# Altium schematic sheet SH2 - MCU.SchDoc
size Letter; Organization: UW Robotics; Address1: 200 University Avenue; Address2: Waterloo; Address3: Ontario; Address4: Canada N2L 3G6
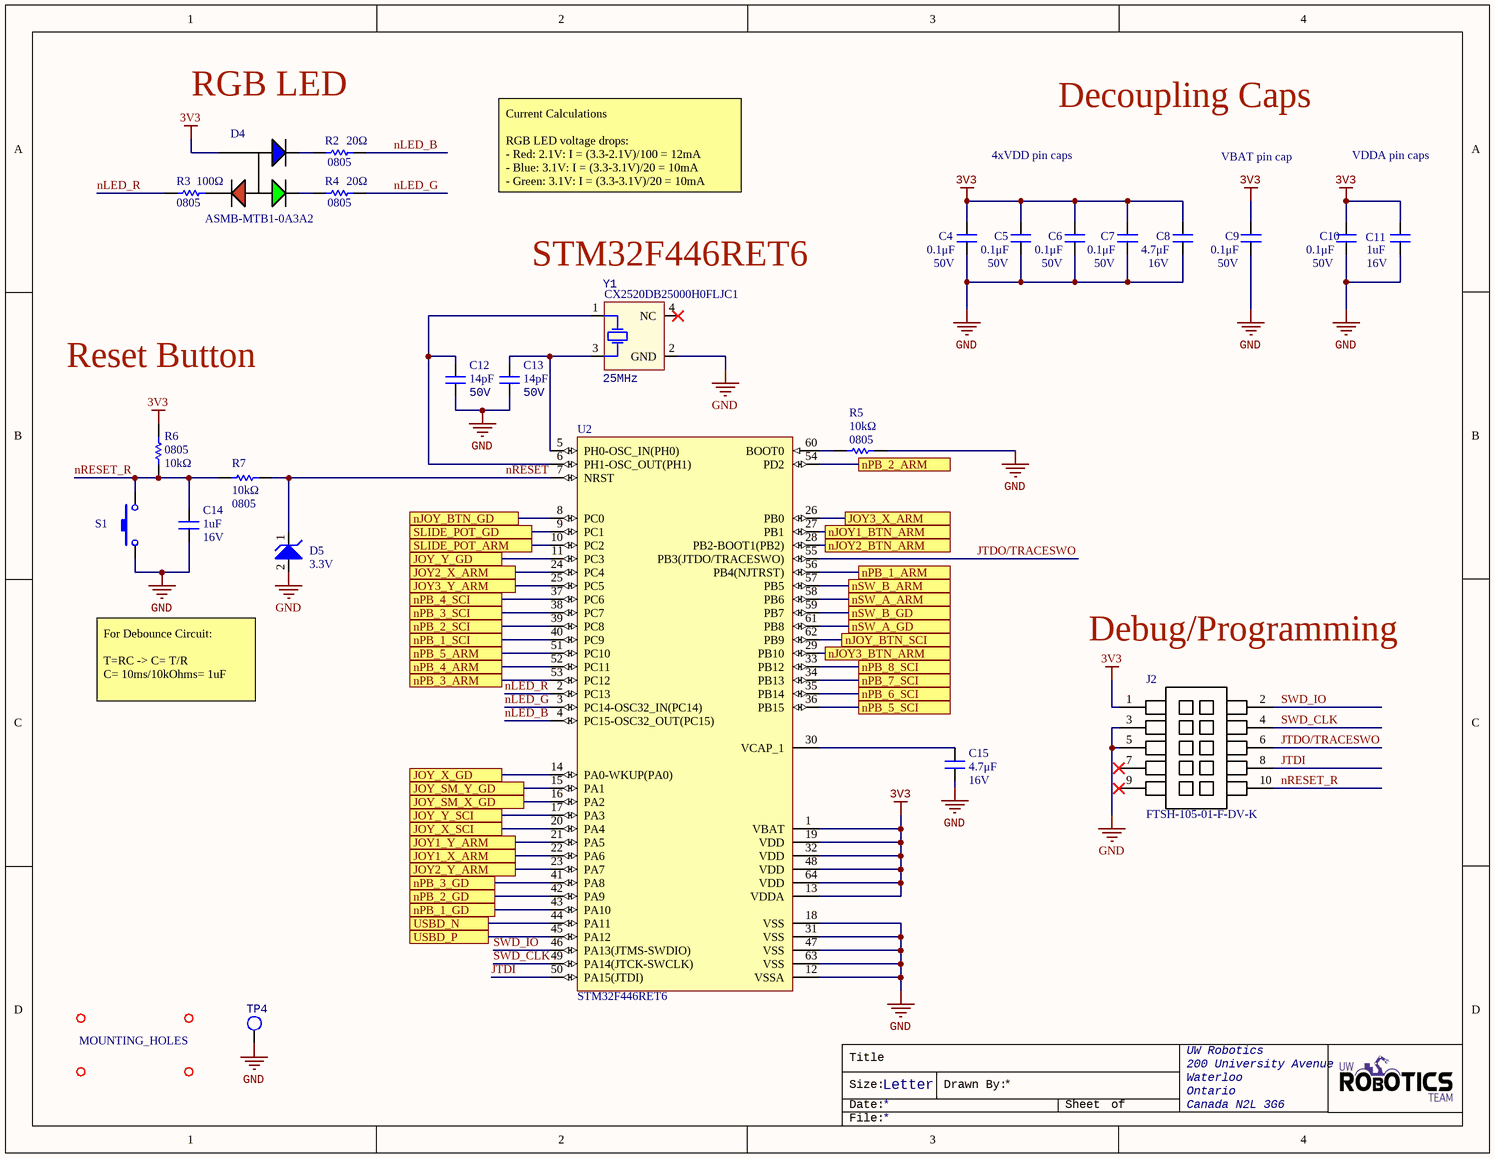
[diagram p0: SH2 - MCU.SchDoc]

## Parts
C4  Voltage Rating: 50V  [CAPC2012X140N]  (hidden comment: 0.1μF)
C5  Voltage Rating: 50V  [CAPC2012X140N]  (hidden comment: 0.1μF)
C6  Voltage Rating: 50V  [CAPC2012X140N]  (hidden comment: 0.1μF)
C7  Voltage Rating: 50V  [CAPC2012X140N]  (hidden comment: 0.1μF)
C8  value 4.7μF  Voltage Rating: 16V  [CAPC2012X140N]  (hidden comment: CAP_4.7uF_16V_0805)
C9  Voltage Rating: 50V  [CAPC2012X140N]  (hidden comment: 0.1μF)
C10  Voltage Rating: 50V  [CAPC2012X140N]  (hidden comment: 0.1μF)
C11  value 1uF  Voltage Rating: 16V  [CAPC2012X140N]  (hidden comment: CAP_1uF_16V_0805)
C12  value 14pF  Voltage Rating (DC): 50V  [CAPC0603(1608)55_N]  (hidden comment: CL10C140JB8NNNC)
C13  value 14pF  Voltage Rating (DC): 50V  [CAPC0603(1608)55_N]  (hidden comment: CL10C140JB8NNNC)
C14  value 1uF  Voltage Rating: 16V  [CAPC2012X140N]  (hidden comment: CAP_1uF_16V_0805)
C15  value 4.7μF  Voltage Rating: 16V  [CAPC2012X140N]  (hidden comment: CAP_4.7uF_16V_0805)
D4  Manufacturer Part Number 1: ASMB-MTB1-0A3A2  [LED_RGB]  (hidden comment: LED_RGB)
D5  Reverse Standoff Voltage: 3.3V  [SOD523]  (hidden comment: TVS_DIODE_UNIDIR_3.3V)
J2  Manufacturer Part Number 1: FTSH-105-01-F-DV-K  [FTSH-105-01-F-DV-K-P-TR]  (hidden comment: CON_PROGRAMMING)
MH1  MOUNTING_HOLES  [MOUNTING_HOLE]  (value not drawn)
MH2  MOUNTING_HOLES  [MOUNTING_HOLE]  (value not drawn)
MH3  MOUNTING_HOLES  [MOUNTING_HOLE]
MH4  MOUNTING_HOLES  [MOUNTING_HOLE]  (value not drawn)
R2  value 20Ω  Case Code (Imperial): 0805  [RESC2012X60N]  (hidden comment: RES_20Ω_0805)
R3  value 100Ω  Case Code (Imperial): 0805  [RESC2012X60N]  (hidden comment: RES_100Ω_0805)
R4  value 20Ω  Case Code (Imperial): 0805  [RESC2012X60N]  (hidden comment: RES_20Ω_0805)
R5  value 10kΩ  Case Code (Imperial): 0805  [RESC2012X60N]  (hidden comment: RES_10kΩ_0805)
R6  value 10kΩ  Case Code (Imperial): 0805  [RESC2012X60N]  (hidden comment: RES_10kΩ_0805)
R7  value 10kΩ  Case Code (Imperial): 0805  [RESC2012X60N]  (hidden comment: RES_10kΩ_0805)
S1  SW_TACTILE  [B3U-1000P]  (value not drawn)
TP4  TESTPOINT_LOOP  [TESTPOINT_LOOP]  (value not drawn)
U2  STM32F446RET6  [STM-LQFP64_L]
Y1  Manufacturer Part Number 1: CX2520DB25000H0FLJC1  Frequency: 25MHz  [SOIC254P1016X440-4N]  (hidden comment: CRYSTAL_25MHZ)

## Ports
JOY1_X_ARM, JOY1_Y_ARM, JOY2_X_ARM, JOY2_Y_ARM, JOY3_X_ARM, JOY3_Y_ARM, JOY_SM_X_GD, JOY_SM_Y_GD, JOY_X_GD, JOY_X_SCI, JOY_Y_GD, JOY_Y_SCI, nJOY1_BTN_ARM, nJOY2_BTN_ARM, nJOY3_BTN_ARM, nJOY_BTN_GD, nJOY_BTN_SCI, nPB_1_ARM, nPB_1_GD, nPB_1_SCI, nPB_2_ARM, nPB_2_GD, nPB_2_SCI, nPB_3_ARM, nPB_3_GD, nPB_3_SCI, nPB_4_ARM, nPB_4_SCI, nPB_5_ARM, nPB_5_SCI, nPB_6_SCI, nPB_7_SCI, nPB_8_SCI, nSW_A_ARM, nSW_A_GD, nSW_B_ARM, nSW_B_GD, SLIDE_POT_ARM, SLIDE_POT_GD, USBD_N, USBD_P

## Nets
3V3: C4.2 C5.2 C6.2 C7.2 C8.2 C9.2 C10.2 C11.2 D4.4 J2.1 R6.2 U2.1(VBAT) U2.13(VDDA) U2.19(VDD) U2.32(VDD) U2.48(VDD) U2.64(VDD)
GND: C4.1 C5.1 C6.1 C7.1 C8.1 C9.1 C10.1 C11.1 C12.1 C13.1 C14.1 C15.1 D5.2 J2.3 J2.5 R5.2 S1.2 TP4.1 U2.12(VSSA) U2.18(VSS) U2.31(VSS) U2.47(VSS) U2.63(VSS) Y1.2(GND)
JOY1_X_ARM: U2.22(PA6) ; port JOY1_X_ARM
JOY1_Y_ARM: U2.21(PA5) ; port JOY1_Y_ARM
JOY2_X_ARM: U2.24(PC4) ; port JOY2_X_ARM
JOY2_Y_ARM: U2.23(PA7) ; port JOY2_Y_ARM
JOY3_X_ARM: U2.26(PB0) ; port JOY3_X_ARM
JOY3_Y_ARM: U2.25(PC5) ; port JOY3_Y_ARM
JOY_SM_X_GD: U2.16(PA2) ; port JOY_SM_X_GD
JOY_SM_Y_GD: U2.15(PA1) ; port JOY_SM_Y_GD
JOY_X_GD: U2.14(PA0-WKUP(PA0)) ; port JOY_X_GD
JOY_X_SCI: U2.20(PA4) ; port JOY_X_SCI
JOY_Y_GD: U2.11(PC3) ; port JOY_Y_GD
JOY_Y_SCI: U2.17(PA3) ; port JOY_Y_SCI
JTDI: J2.8 U2.50(PA15(JTDI))
JTDO/TRACESWO: J2.6 U2.55(PB3(JTDO/TRACESWO))
nJOY1_BTN_ARM: U2.27(PB1) ; port nJOY1_BTN_ARM
nJOY2_BTN_ARM: U2.28(PB2-BOOT1(PB2)) ; port nJOY2_BTN_ARM
nJOY3_BTN_ARM: U2.29(PB10) ; port nJOY3_BTN_ARM
nJOY_BTN_GD: U2.8(PC0) ; port nJOY_BTN_GD
nJOY_BTN_SCI: U2.62(PB9) ; port nJOY_BTN_SCI
nLED_B: R2.2 U2.4(PC15-OSC32_OUT(PC15))
nLED_G: R4.2 U2.3(PC14-OSC32_IN(PC14))
nLED_R: R3.1 U2.2(PC13)
nPB_1_ARM: U2.56(PB4(NJTRST)) ; port nPB_1_ARM
nPB_1_GD: U2.43(PA10) ; port nPB_1_GD
nPB_1_SCI: U2.40(PC9) ; port nPB_1_SCI
nPB_2_ARM: U2.54(PD2) ; port nPB_2_ARM
nPB_2_GD: U2.42(PA9) ; port nPB_2_GD
nPB_2_SCI: U2.39(PC8) ; port nPB_2_SCI
nPB_3_ARM: U2.53(PC12) ; port nPB_3_ARM
nPB_3_GD: U2.41(PA8) ; port nPB_3_GD
nPB_3_SCI: U2.38(PC7) ; port nPB_3_SCI
nPB_4_ARM: U2.52(PC11) ; port nPB_4_ARM
nPB_4_SCI: U2.37(PC6) ; port nPB_4_SCI
nPB_5_ARM: U2.51(PC10) ; port nPB_5_ARM
nPB_5_SCI: U2.36(PB15) ; port nPB_5_SCI
nPB_6_SCI: U2.35(PB14) ; port nPB_6_SCI
nPB_7_SCI: U2.34(PB13) ; port nPB_7_SCI
nPB_8_SCI: U2.33(PB12) ; port nPB_8_SCI
nRESET: D5.1 R7.2 U2.7(NRST)
nRESET_R: C14.2 J2.10 R6.1 R7.1 S1.1
nSW_A_ARM: U2.58(PB6) ; port nSW_A_ARM
nSW_A_GD: U2.61(PB8) ; port nSW_A_GD
nSW_B_ARM: U2.57(PB5) ; port nSW_B_ARM
nSW_B_GD: U2.59(PB7) ; port nSW_B_GD
SLIDE_POT_ARM: U2.10(PC2) ; port SLIDE_POT_ARM
SLIDE_POT_GD: U2.9(PC1) ; port SLIDE_POT_GD
SWD_CLK: J2.4 U2.49(PA14(JTCK-SWCLK))
SWD_IO: J2.2 U2.46(PA13(JTMS-SWDIO))
USBD_N: U2.44(PA11) ; port USBD_N
USBD_P: U2.45(PA12) ; port USBD_P
NetC12_2: C12.2 U2.6(PH1-OSC_OUT(PH1)) Y1.1(HOT)
NetC13_2: C13.2 U2.5(PH0-OSC_IN(PH0)) Y1.3(HOT)
NetC15_2: C15.2 U2.30(VCAP_1)
NetD4_1: D4.1 R3.2
NetD4_2: D4.2 R4.1
NetD4_3: D4.3 R2.1
NetR5_1: R5.1 U2.60(BOOT0)

Not connected (* = marked no-connect by the designer): J2 7* 9*; Y1 4(NC)*

## Notes on the sheet
- RGB LED
- 4xVDD pin caps
- Decoupling Caps
- VBAT pin cap
- VDDA pin caps
- Current Calculations
  RGB LED voltage drops:
  - Red: 2.1V: I = (3.3-2.1V)/100 = 12mA
  - Blue: 3.1V: I = (3.3-3.1V)/20 = 10mA
  - Green: 3.1V: I = (3.3-3.1V)/20 = 10mA
- (near Y1) STM32F446RET6
- Reset Button
- For Debounce Circuit:
  T=RC -> C= T/R
  C= 10ms/10kOhms= 1uF
- Debug/Programming
- Title
- Size:
- Date:
- Letter
- Drawn By:
- Sheet
- of
- File:

## Library data of the parts
C4-C7 C9 C10 = CAP_0.1uF_50V_0805: CAP CER 0.1UF 50V X7R 0805; Manufacturer 1: Murata Electronics; Manufacturer Part Number 1: GCD21BR71H104KA01L; Tolerance: 10%; Mount: Surface Mount; Case Code (Metric): 2012; Case Code (Imperial): 0805; Min Operating Temperature: -55°C; Max Operating Temperature: 125°C; Dielectric: X7R; Termination: SMD/SMT; Length: 2mm; Height: 1.25mm; Width: 0.049inch; Thickness: 0.049inch; Depth: 1.25mm; Ratings: AEC-Q200; ComponentLink1URL: https://datasheet.ciiva.com/29537/c03e-29537701.pdf?src-supplier=Digi-Key; ComponentLink1Description: https://datasheet.ciiva.com/29537/c03e-29537701.pdf?src-supplier=Digi-Key; Supplier 1: Digi-Key; Supplier Part Number 1: 490-11955-1-ND; Value: 0.1μF; Package: 0805 (2012 Metric)
C8 C15 = CAP_4.7uF_16V_0805: CAP CER 4.7UF 16V X5R 0805; Manufacturer 1: Samsung Electro-Mechanics; Manufacturer Part Number 1: CL21A475KOFNNNE; Tolerance: 10%; Mount: Surface Mount; Case Code (Metric): 2012; Case Code (Imperial): 0805; Min Operating Temperature: -55°C; Max Operating Temperature: 85°C; Dielectric: X5R; Termination: SMD/SMT; Supplier 1: Digi-Key; Supplier Part Number 1: 1276-1065-1-ND; Package: 0805 (2012 Metric)
C11 C14 = CAP_1uF_16V_0805: CAP CER 1UF 16V X7R 0805; Manufacturer 1: Yageo; Manufacturer Part Number 1: CC0805KKX7R7BB105; Tolerance: 10%; Mount: Surface Mount; Case Code (Metric): 2012; Case Code (Imperial): 0805; Min Operating Temperature: -55°C; Max Operating Temperature: 125°C; Dielectric: X7R; Termination: SMD/SMT; Supplier 1: Digi-Key; Supplier Part Number 1: 311-1365-1-ND; Package: 0805 (2012 Metric)
C12 C13 = CL10C140JB8NNNC: Cap Ceramic 14pF 50V C0G 5% SMD 0603 125C Cardboard T/R; Manufacturer 1: Samsung; Voltage Rating: 50V; Supplier Part Number 1: 1276-2187-1-ND; Supplier 1: Digi-Key; Manufacturer Part Number 1: CL10C140JB8NNNC; Stock 1: 187088; Pricing 1: 1=0.10000, 10=0.06700, 100=0.02980, 500=0.02130, 1000=0.01673 (USD); RoHS: Yes; Mount: Surface Mount; Case/Package: 0603; Case Code (Metric): 1608; Case Code (Imperial): 0603; Min Operating Temperature: -55°C; Max Operating Temperature: 125°C; Tolerance: 5%; Package Quantity: 1; Packaging: Tape and Reel; Dielectric: C0G; Length: 1.6mm; Height: 0.8mm; Width: 0.031inch; Depth: 0.8mm; Thickness: 0.035inch; Radiation Hardening: No; ComponentLink1URL: https://datasheet.ciiva.com/25782/cl10c140jb8nnnc-25782947.pdf?src-supplier=Digi-Key; ComponentLink1Description: https://datasheet.ciiva.com/25782/cl10c140jb8nnnc-25782947.pdf?src-supplier=Digi-Key; Capacitance: 14pF
D4 = LED_RGB: LED RGB DIFFUSED 4PLCC SMD; Manufacturer 1: Broadcom; Color: Blue,Green,Red; Lens Color: White; Viewing Angle: 115°; Lens Style: Round; Luminous Intensity: 350mcd; Dominant Wavelength: 470nm; Forward Voltage: 3.1V; Test Current: 20mA; Supplier 1: Digi-Key; Stock 1: 142531; Pricing 1: 1=0.60000, 10=0.47100, 100=0.30210, 500=0.25980, 1000=0.20059 (USD); RoHS: Yes; Mount: Surface Mount; Case/Package: PLCC; Number of Pins: 4; Packaging: Cut Tape; Lens Transparency: Diffused; Length: 3.2mm; Height: 1.9mm; Width: 2.8mm; REACH SVHC: No SVHC; ComponentLink1URL: http://www.farnell.com/datasheets/2111106.pdf?src-supplier=Farnell; ComponentLink1Description: http://www.farnell.com/datasheets/2111106.pdf?src-supplier=Farnell; ComponentLink2URL: https://docs.broadcom.com/docs/AV02-4194EN?src-supplier=Digi-Key; ComponentLink2Description: https://docs.broadcom.com/docs/AV02-4194EN?src-supplier=Digi-Key; ComponentLink3URL: http://www.farnell.com/datasheets/1801564.pdf?src-supplier=Element14; ComponentLink3Description: http://www.farnell.com/datasheets/1801564.pdf?src-supplier=Element14; ComponentLink4URL: http://www.farnell.com/datasheets/2111106.pdf?src-supplier=Newark; ComponentLink4Description: http://www.farnell.com/datasheets/2111106.pdf?src-supplier=Newark; Supplier Part Number 1: 516-3280-1-ND
D5 = TVS_DIODE_UNIDIR_3.3V: TVS DIODE 3.3V 14.1V SOD523. Used to protect each connector input line going into the MCU.; Manufacturer 1: ON Semiconductor; Manufacturer Part Number 1: ESD5Z3.3T1G; Reverse Breakdown Voltage: 5V; Peak Pulse Power: 158W; Power Line Protection: No; Number of Channels: 1; Polarity: Unidirectional; Peak Pulse Current: 11.2A; Supplier 1: Digi-Key; Mount: Surface Mount; Number of Pins: 2; Min Operating Temperature: -55°C; Max Operating Temperature: 150°C; Clamping Voltage: 14.1V; Composition: Zener; Supplier Part Number 1: ESD5Z3.3T1GOSCT-ND
J2 = CON_PROGRAMMING: Board Connector, 10 Contact(s), 2 Row(s), Male, Straight, 0.05 inch Pitch, Surface Mount Terminal, Locking; Manufacturer 1: Samtec; Number of Contacts: 10; Connector Type: Male Pin; Max Current Rating: 1.75A; Pitch: 1.27mm; Supplier 1: Digi-Key; RoHS: Yes; Category: Headers and Wire Housings; Stock 1: 19926; Pricing 1: 1=2.90000, 10=2.78400, 100=2.32000, 500=1.97200, 1000=1.68200, 5000=1.50800 (USD); Mount: Surface Mount; Contact Plating: Gold; Contact Material: Copper,Bronze; Housing Color: Black; Housing Material: Polymer; Color: Black; Min Operating Temperature: -55°C; Max Operating Temperature: 125°C; Number of Rows: 2; Termination: Solder; Packaging: Rail/Tube; Orientation: Straight; Package Quantity: 1; Number of Positions: 10; Length: 15.2mm; Height: 3.3mm; Depth: 3.43mm; Row Spacing: 0.05inch; Contact Mating Length: 0.12inch; Radiation Hardening: No; Lead Free: Lead Free; ComponentLink1URL: https://datasheet.ciiva.com:443/pdfs/VipMasterIC/IC/SAMI/SAMI-S-A0003531380/SAMI-S-A0003531380-1.pdf?src-supplier=IHS+Markit; ComponentLink1Description: https://datasheet.ciiva.com:443/pdfs/VipMasterIC/IC/SAMI/SAMI-S-A0003531380/SAMI-S-A0003531380-1.pdf?src-supplier=IHS+Markit; ComponentLink2URL: https://datasheet.ciiva.com/19461/2046846-19461026.pdf?src-supplier=Jameco; ComponentLink2Description: https://datasheet.ciiva.com/19461/2046846-19461026.pdf?src-supplier=Jameco; ComponentLink3URL: https://datasheet.ciiva.com/16657/ftsh-mt-16657371.pdf?src-supplier=Avnet+Europe; ComponentLink3Description: https://datasheet.ciiva.com/16657/ftsh-mt-16657371.pdf?src-supplier=Avnet+Europe; ComponentLink4URL: https://datasheet.ciiva.com/15195/getdatasheetpartid-133463-15195260.pdf?src-supplier=Verical; ComponentLink4Description: https://datasheet.ciiva.com/15195/getdatasheetpartid-133463-15195260.pdf?src-supplier=Verical; ComponentLink5URL: https://datasheet.ciiva.com/738/ftsh-1xx-xx-xxx-dv-xxx-mkt-738998.pdf?src-supplier=Digi-Key; ComponentLink5Description: https://datasheet.ciiva.com/738/ftsh-1xx-xx-xxx-dv-xxx-mkt-738998.pdf?src-supplier=Digi-Key; ComponentLink6URL: https://datasheet.ciiva.com/10245/ftsh-mt-10245273.pdf?src-supplier=Avnet; ComponentLink6Description: https://datasheet.ciiva.com/10245/ftsh-mt-10245273.pdf?src-supplier=Avnet; Supplier Part Number 1: SAM8796-ND
MH1-MH4 = MOUNTING_HOLES: 6cm x 6cm
R2 R4 = RES_20Ω_0805: RES SMD 20 OHM 1% 1/8W 0805; Manufacturer 1: Yageo; Manufacturer Part Number 1: RC0805FR-0720RL; Resistance: 20; Power Rating: 125mW; Supplier 1: Digi-Key; Case Code (Metric): 2012; Min Operating Temperature: -55°C; Max Operating Temperature: 155°C; Tolerance: 1%; Termination: SMD/SMT; Supplier Part Number 1: 311-20.0CRCT-ND; Package: 0805 (2012 Metric)
R3 = RES_100Ω_0805: RES SMD 100 OHM 1% 1/8W 0805; Manufacturer 1: Yageo; Manufacturer Part Number 1: RC0805FR-07100RL; Power Rating: 125mW; Supplier 1: Digi-Key; Mount: Surface Mount; Case Code (Metric): 2012; Supplier Part Number 1: 311-100CRCT-ND; Package: 0805 (2012 Metric)
R5-R7 = RES_10kΩ_0805: RES SMD 10K OHM 1% 1/8W 0805; Manufacturer 1: Yageo; Manufacturer Part Number 1: RC0805FR-0710KL; Power Rating: 125mW; Supplier 1: Digi-Key; Case Code (Metric): 2012; Min Operating Temperature: -55°C; Max Operating Temperature: 155°C; Resistance: 10K; Tolerance: 1%; Termination: SMD/SMT; Supplier Part Number 1: 311-10.0KCRCT-ND; Package: 0805 (2012 Metric)
S1 = SW_TACTILE: Tactile Switch (Grey); Manufacturer 1: Omron Electronics Inc-EMC Div; Manufacturer Part Number 1: B3U-1000P; Supplier 1: Digi-Key; Supplier Part Number 1: SW1020CT-ND; Mount: Surface Mount
TP4 = TESTPOINT_LOOP: Loop testpoint through-hole pad; Manufacturer Part Number 1: 5002; Manufacturer 1: Keystone Electronics; Supplier Part Number 1: 36-5002-ND; Supplier 1: Digi-Key; Mount: Through Hole
U2 = MCU_STM32F446RET6: ARM Cortex-M4 32-bit MCU+FPU, 512 KB Flash, 128 KB Internal RAM, 50 I/Os, 64-Pin LQFP, -40 to 85 degC, Tray; I/Os (High Current): 50; Supply Voltage(Vcc) min (V): 1.7; Operating Frequency(F) (Processor speed) (MHz): 180; D/A Converter: 2; Internal RAM Size (kB): 128; FLASH Size (Prog) (kB): 512; Core: ARM Cortex-M4; ComponentLink1Description: Manufacturer URL; Package Reference: 64-Pin Low-profile Quad Flat Package, Body 10 x 10 mm, Pitch 0.5 mm; ComponentLink2URL: http://www.st.com/st-web-ui/static/active/en/resource/technical/document/datasheet/DM00141306.pdf; Packing: Tray; DatasheetVersion: Rev. 6; ComponentLink1URL: http://www.st.com/; ComponentLink2Description: Datasheet; Package Description: LQFP64; Mounting Technology: Surface Mount; Supplier Part Number 1: 497-15376-ND; Supplier 1: Digi-Key
Y1 = CRYSTAL_25MHZ: CRYSTAL 25.0000MHZ 12PF SMD; Manufacturer 1: Kyocera AVX; ESR (Equivalent Series Resistance): 80R; Frequency Stability: 15ppm; Frequency Tolerance: 10ppm; ComponentLink1Description: https://media.digikey.com/pdf/Data%20Sheets/AVX%20PDFs/CX2520DB_USY1M-H1-16429-00_Spec.pdf?src-supplier=Digi-Key; ComponentLink1URL: https://media.digikey.com/pdf/Data%20Sheets/AVX%20PDFs/CX2520DB_USY1M-H1-16429-00_Spec.pdf?src-supplier=Digi-Key; Supplier 1: Digi-Key; Supplier Part Number 1: 1253-1724-1-ND; Stock 1: 11741; Pricing 1: 1=0.72000, 10=0.63300, 50=0.59120, 100=0.52250, 500=0.49500, 1000=0.41250 (USD); RoHS: Yes; Mount: Surface Mount; Case/Package: SMD/SMT; Min Operating Temperature: -30°C; Max Operating Temperature: 85°C; Packaging: Tape and Reel; Load Capacitance: 12pF; Length: 0.098inch; Height: 0.022inch; Width: 0.079inch; Ratings: AEC-Q200